# Altium project Thermostat_EEM.PrjPCB (part 6 of 6)

## Sheet EEM_connector.SchDoc: Stabilizer
size 420 x 297 mm; Author: G.Kasprowicz; CompanyName: WUT ISE; DrawnBy: G.Kasprowicz; Organization: WUT ISE; Address1: PW ISE; Address2: Nowowiejska 15/19 00-665 Warsaw; Address3: gkasprow@gmail.com; DocumentNumber: 7; Revision: 1.0; SheetNumber: 7; SheetTotal: 9; ModifiedBy: -; CheckedDate: -; Title2: EEM connector & drivers; DivGrp: WUT ISE; Designer: G.Kasprowicz; ModifiedDate: -; ProjectName: Sensor Box
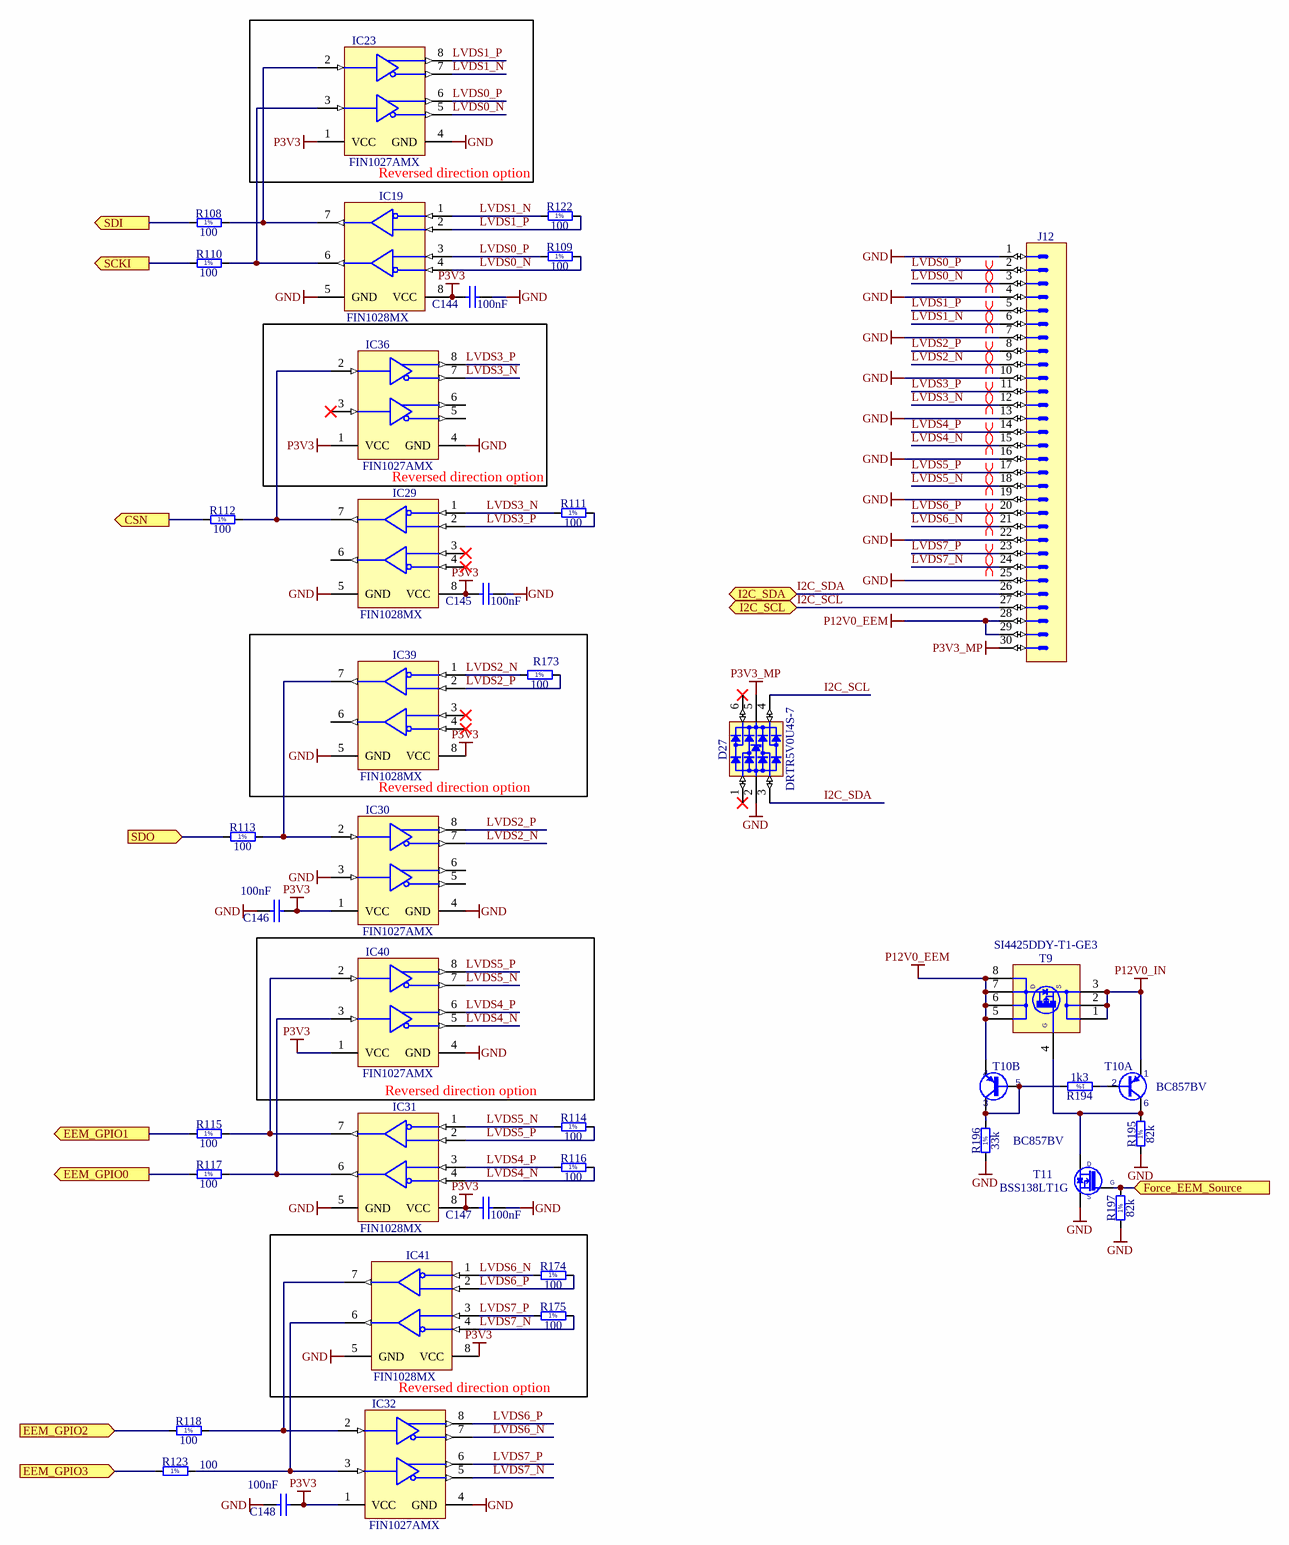
[diagram p7: EEM_connector.SchDoc]

### Parts
C144  100nF  [CAPC1005X55N]
C145  100nF  [CAPC1005X55N]
C146  100nF  [CAPC1005X55N]
C147  100nF  [CAPC1005X55N]
C148  100nF  [CAPC1005X55N]
D27  DRTR5V0U4S-7  [SOT65P210X110-6N]
IC19  FIN1028MX  [SOIC127P600X175-8N]
IC23  FIN1027AMX  [SOIC127P600X175-8N]
IC29  FIN1028MX  [SOIC127P600X175-8N]
IC30  FIN1027AMX  [SOIC127P600X175-8N]
IC31  FIN1028MX  [SOIC127P600X175-8N]
IC32  FIN1027AMX  [SOIC127P600X175-8N]
IC36  FIN1027AMX  [SOIC127P600X175-8N]
IC39  FIN1028MX  [SOIC127P600X175-8N]
IC40  FIN1027AMX  [SOIC127P600X175-8N]
IC41  FIN1028MX  [SOIC127P600X175-8N]
J12  (no value)  [3M_N2530-6002RB]
R108  100  [RESC1005X40N]
R109  100  [RESC1005X40N]
R110  100  [RESC1005X40N]
R111  100  [RESC1005X40N]
R112  100  [RESC1005X40N]
R113  100  [RESC1005X40N]
R114  100  [RESC1005X40N]
R115  100  [RESC1005X40N]
R116  100  [RESC1005X40N]
R117  100  [RESC1005X40N]
R118  100  [RESC1005X40N]
R122  100  [RESC1005X40N]
R123  100  [RESC1005X40N]
R173  100  [RESC1005X40N]
R174  100  [RESC1005X40N]
R175  100  [RESC1005X40N]
R194  1k3  [RESC1608X55N]
R195  82k  [RESC1608X55N]
R196  33k  [RESC1005X40N]
R197  82k  [RESC1608X55N]
T9  SI4425DDY-T1-GE3  [SOIC127P600X175-8N]
T10  BC857BV  [SOTFL50P160X60-6N]  (parts A,B of 2)
T11  BSS138LT1G  [SOT95P240X110-3N]

### Blocks framed on the sheet
Reversed direction option: IC23
Reversed direction option: IC36
Reversed direction option: IC39 R173
Reversed direction option: IC40
Reversed direction option: IC41 R174 R175

### Ports
CSN (out), EEM_GPIO0 (out), EEM_GPIO1 (out), EEM_GPIO2 (in), EEM_GPIO3 (in), Force_EEM_Source (in), I2C_SCL (bidir), I2C_SDA (bidir), SCKI (out), SDI (out), SDO (in)

### Nets
GND: C144.1 C145.1 C146.1 C147.1 C148.1 D27.2(GND) IC19.5(GND) IC23.4(GND) IC29.5(GND) IC30.3(DIN2RIN-) IC30.4(GND) IC31.5(GND) IC32.4(GND) IC36.4(GND) IC39.5(GND) IC40.4(GND) IC41.5(GND) J12.1 J12.4 J12.7 J12.10 J12.13 J12.16 J12.19 J12.22 J12.25 R195.1 R196.1 R197.1 T11.2(S)
P3V3: C144.2 C145.2 C146.2 C147.2 C148.2 IC19.8(VCC) IC23.1(VCC) IC29.8(VCC) IC30.1(VCC) IC31.8(VCC) IC32.1(VCC) IC36.1(VCC) IC39.8(VCC) IC40.1(VCC) IC41.8(VCC)
P3V3_MP: D27.5(VBUS) J12.30
P12V0_EEM: J12.28 J12.29 T9.5(D) T9.6(D) T9.7(D) T9.8(D) T10.4(E)
P12V0_IN: T9.1(S) T9.2(S) T9.3(S) T10.1(E)
I2C_SCL: D27.4(I/O3) J12.27 ; port I2C_SCL
I2C_SDA: D27.3(I/O2) J12.26 ; port I2C_SDA
LVDS0_N: IC19.4(RIN2-) IC23.5(DOUT-) J12.3 R109.2
LVDS0_P: IC19.3(RIN2+) IC23.6(DOUT+) J12.2 R109.1
LVDS1_N: IC19.1(RIN1-) IC23.7(DOUT-) J12.6 R122.1
LVDS1_P: IC19.2(RIN1+) IC23.8(DOUT+) J12.5 R122.2
LVDS2_N: IC30.7(DOUT-) IC39.1(RIN1-) J12.9 R173.1
LVDS2_P: IC30.8(DOUT+) IC39.2(RIN1+) J12.8 R173.2
LVDS3_N: IC29.1(RIN1-) IC36.7(DOUT-) J12.12 R111.1
LVDS3_P: IC29.2(RIN1+) IC36.8(DOUT+) J12.11 R111.2
LVDS4_N: IC31.4(RIN2-) IC40.5(DOUT-) J12.15 R116.2
LVDS4_P: IC31.3(RIN2+) IC40.6(DOUT+) J12.14 R116.1
LVDS5_N: IC31.1(RIN1-) IC40.7(DOUT-) J12.18 R114.1
LVDS5_P: IC31.2(RIN1+) IC40.8(DOUT+) J12.17 R114.2
LVDS6_N: IC32.7(DOUT-) IC41.1(RIN1-) J12.21 R174.1
LVDS6_P: IC32.8(DOUT+) IC41.2(RIN1+) J12.20 R174.2
LVDS7_N: IC32.5(DOUT-) IC41.4(RIN2-) J12.24 R175.2
LVDS7_P: IC32.6(DOUT+) IC41.3(RIN2+) J12.23 R175.1
NetIC9_73: R112.1 ; port CSN
NetIC9_75: R113.1 ; port SDO
NetIC9_76: R108.1 ; port SDI
NetIC9_114: R197.2 T11.1(G) ; port Force_EEM_Source
NetIC9_117: R110.1 ; port SCKI
NetIC9_118: R117.1 ; port EEM_GPIO0
NetIC9_119: R115.1 ; port EEM_GPIO1
NetIC9_122: R118.1 ; port EEM_GPIO2
NetIC9_123: R123.1 ; port EEM_GPIO3
NetIC19_6: IC19.6(ROUT2) IC23.3(DIN2RIN-) R110.2
NetIC19_7: IC19.7(ROUT1) IC23.2(DIN1) R108.2
NetIC29_7: IC29.7(ROUT1) IC36.2(DIN1) R112.2
NetIC30_2: IC30.2(DIN1) IC39.7(ROUT1) R113.2
NetIC31_6: IC31.6(ROUT2) IC40.3(DIN2RIN-) R117.2
NetIC31_7: IC31.7(ROUT1) IC40.2(DIN1) R115.2
NetIC32_2: IC32.2(DIN1) IC41.7(ROUT1) R118.2
NetIC32_3: IC32.3(DIN2RIN-) IC41.6(ROUT2) R123.2
NetR194_1: R194.1 T10.2(B)
NetR194_2: R194.2 R196.2 T10.3(C) T10.5(B)
NetR195_2: R195.2 T9.4(S) T10.6(C) T11.3(D)

Not connected (* = marked no-connect by the designer): D27 1(I/O1)* 6(I/O4)*; IC29 3(RIN2+)* 4(RIN2-)* 6(ROUT2); IC30 5(DOUT-) 6(DOUT+); IC36 3(DIN2RIN-)* 5(DOUT-) 6(DOUT+); IC39 3(RIN2+)* 4(RIN2-)* 6(ROUT2)

### Layout directives
differential pair: LVDS0_N, LVDS0_P, LVDS1_N, LVDS1_P, LVDS2_N, LVDS2_P, LVDS3_N, LVDS3_P, LVDS4_N, LVDS4_P, LVDS5_N, LVDS5_P, LVDS6_N, LVDS6_P, LVDS7_N, LVDS7_P

### Notes on the sheet
- Project/Equipment
- Document
- Designer
- Drawn by
- Check.by
- Copyright WUT ISE 2024.
  This documentation describes Open Hardware and is licensed under the CERN OHL-W v.2.0. You may redistribute and modify this documentation under the terms of the CERN OHL-W v.2.0. (http://ohwr.org/CERNOHL). This documentation is distributed WITHOUT ANY EXPRESS OR IMPLIED WARRANTY, INCLUDING OF MERCHANTABILITY, SATISFACTORY QUALITY AND FITNESS FOR A PARTICULAR PURPOSE. Please see the CERN OHL v.2.0 for applicable conditions.
- Contact
- File
- Last Mod.
- Print Date
- Sheet
- Size
- A3
- of
- Rev
- (in symbol R0402_33K_1%_0.0625W_100PPM) 1%
- (in symbol R0402_100R_1%_0.0625W_100PPM) 1%
- (in symbol R0603_1K3_1%_0.1W_100PPM) 1%
- (in symbol R0603_82K_1%_0.1W_100PPM) 1%
- (in symbol SI4425DDY-T1-GE3) G

### Library data of the parts
C144-C148 = CC0402_100NF_16V_10%_X5R: as C79-C81 on sheet RMII_Ethernet; Part Number: CC0402_100NF_16V_10%_X5R; Component Kind: Standard; Component Type: Standard; Pin Count: 2; Value: 100nF; Status: None; Manufacturer Part Number: CC0402_100NF_16V_10%_X5R; Case: 0402; Mounted: Yes; Socket: No; SMD: Yes; Sense: No; Manufacturer1 Example: MURATA; Manufacturer1 ComponentHeight: 0.55mm; HelpURL: \\cern.ch\dfs\Applications\Altium\Datasheets\CC0402_X5R_MURATA_GRM.pdf; Author: CERN DEM JLC; CreateDate: 10.12.2013; LatestRevisionDate: 10.12.2013
D27 = D_TVS_DRTR5V0U4S-7: Integrated Quad Ultra-Low Capacitance ESD Protection; Part Description: Integrated Quad Ultra-Low Capacitance ESD (±8kV) Protection; Manufacturer: DIODES; PressFit: No; Bonding: No; Status Comment: Active; Part Number: DRTR5V0U4S-7; Component Kind: Standard; Component Type: Standard; Device: DRTR5V0U4S-7; PackageDescription: SOT363, SC70-6, 0.65mm Pitch; 6 Pin, 1.25mm W X 2.00mm L X 1.10mm H body, IPC Medium Density; Status: Active; Manufacturer Part Number: DRTR5V0U4S-7; Pin Count: 6; Case: SOT363; Mounted: Yes; Socket: No; SMD: Yes; Sense: No; ComponentHeight: 1.1mm; HelpURL: \\cern.ch\dfs\Applications\Altium\Datasheets\PRTR5V0U4Y.pdf; Author: GK; CreateDate: 24.01.2017; LatestRevisionDate: 14.09.2020
IC19 IC29 IC31 IC39 IC41 = IFC_FIN1028: 3.3V LVDS 2-Bit High-Speed Differential Reciever; Manufacturer: ON Semiconductor; PressFit: No; Bonding: No; Part Number: FIN1028MX; Component Kind: Standard; Component Type: Standard; Device: FIN1028MX; PackageDescription: SOIC 8, Pitch 1.27mm - Body 4x5mm, IPC Medium Density; Part Description: 3.3V LVDS 2-Bit High-Speed Differential Reciever; Manufacturer Part Number: FIN1028MX; Pin Count: 8; Case: SOIC8; Mounted: Yes; Socket: No; SMD: Yes; Sense: No; ComponentHeight: 0.8mm; Author: GK; HelpURL: \\cern.ch\dfs\Applications\Altium\Datasheets\FIN1101K8X.pdf; CreateDate: 08/11/2016; LatestRevisionDate: 08/11/2016
IC23 IC30 IC32 IC36 IC40 = IFC_FIN1027A: 3.3V LVDS, 2-Bit, High-Speed, Differential Driver; Manufacturer: ON Semiconductor; PressFit: No; Bonding: No; Part Number: FIN1027AMX; Component Kind: Standard; Component Type: Standard; Device: FIN1027AMX; PackageDescription: SOIC 8, Pitch 1.27mm - Body 4x5mm, IPC Medium Density; Part Description: 3.3V LVDS, 2-Bit, High-Speed, Differential Driver; Manufacturer Part Number: FIN1027AMX; Pin Count: 8; Case: SOIC8; Mounted: Yes; Socket: No; SMD: Yes; Sense: No; ComponentHeight: 0.8mm; Author: GK; HelpURL: \\cern.ch\dfs\Applications\Altium\Datasheets\FIN1101K8X.pdf; CreateDate: 08/11/2016; LatestRevisionDate: 08/11/2016
J12 = 3M_N2530-6002RB: Connector 30 Male; Part Description: 30 Contacts - Straight .100'' x .100'' Low Profile Four-Wall Header, 2500 Series; Manufacturer: 3M; PressFit: No; Part Number: 3M_N2530-6002RB; Component Kind: Standard; Component Type: Standard; Pin Count: 30; Family: Header 30; Mounted: Yes; Socket: No; SMD: No; Sense: No; Status: None; Manufacturer Part Number: N2530-6002RB; ComponentHeight: 10.03mm; HelpURL: \\cern.ch\dfs\Applications\Altium\Datasheets\3M_N2530-6002RB.pdf; Author: CERN DEM JLC; CreateDate: 11.02.2009; LatestRevisionDate: 11.08.2009
R108-R118 R122 R123 R173-R175 = R0402_100R_1%_0.0625W_100PPM: Resistor - 1%; Part Description: General Purpose Thick Film Chip Resistor; Manufacturer: GENERIC; Manufacturer1 Part Number: 232270671001L; TC: ±100ppm/°C; PressFit: No; Part Number: R0402_100R_1%_0.0625W_100PPM; Component Kind: Standard; Component Type: Standard; Pin Count: 2; Value: 100; Status: Not Recommended; Power: 0.0625W; Tolerance: ±1%; Manufacturer Part Number: R0402_100R_1%_0.0625W_100PPM; Case: 0402; Mounted: Yes; Sense: No; Socket: No; SMD: Yes; Manufacturer1 Example: YAGEO PHYCOMP; Manufacturer1 ComponentHeight: 0.4mm; HelpURL: \\cern.ch\dfs\Applications\Altium\Datasheets\R0402_Phycomp_RC0402.pdf; Author: CERN DEM JLC; CreateDate: 03.12.2007; LatestRevisionDate: 17.10.2012
R194 = R0603_1K3_1%_0.1W_100PPM: Resistor - 1%; Part Description: General Purpose Thick Film Chip Resistor; Manufacturer: GENERIC; Manufacturer1 Part Number: NRC06F1301TRF; Power: 0.1W; TC: ±100ppm/°C; PressFit: No; Part Number: R0603_1K3_1%_0.1W_100PPM; Component Kind: Standard; Component Type: Standard; Pin Count: 2; Value: 1k3; Status: Preferred; Tolerance: ±1%; Manufacturer Part Number: R0603_1K3_1%_0.1W_100PPM; Case: 0603; Mounted: Yes; Sense: No; Socket: No; SMD: Yes; Manufacturer1 Example: NIC COMPONENT; Manufacturer1 ComponentHeight: 0.55mm; HelpURL: \\cern.ch\dfs\Applications\Altium\Datasheets\R0603_NIC_NRC.pdf; Author: CERN DEM JLC; CreateDate: 03.12.2007; LatestRevisionDate: 13.03.2008
R195 R197 = R0603_82K_1%_0.1W_100PPM: Resistor - 1%; Part Description: General Purpose Thick Film Chip Resistor; Manufacturer: GENERIC; Manufacturer1 Part Number: NRC06F8202TRF; Power: 0.1W; TC: ±100ppm/°C; Part Number: R0603_82K_1%_0.1W_100PPM; Component Kind: Standard; Component Type: Standard; Pin Count: 2; Value: 82k; Status: Preferred; Tolerance: ±1%; Manufacturer Part Number: R0603_82K_1%_0.1W_100PPM; Case: 0603; Mounted: Yes; Sense: No; Socket: No; SMD: Yes; Manufacturer1 Example: NIC COMPONENT; Manufacturer1 ComponentHeight: 0.55mm; HelpURL: \\cern.ch\dfs\Applications\Altium\Datasheets\R0603_NIC_NRC.pdf; Author: CERN DEM JLC; CreateDate: 03.12.2007; LatestRevisionDate: 13.03.2008
R196 = R0402_33K_1%_0.0625W_100PPM: Resistor - 1%; Part Description: General Purpose Thick Film Chip Resistor; Manufacturer: GENERIC; Manufacturer1 Part Number: 232270673303L; TC: ±100ppm/°C; PressFit: No; Part Number: R0402_33K_1%_0.0625W_100PPM; Component Kind: Standard; Component Type: Standard; Pin Count: 2; Value: 33k; Status: Not Recommended; Power: 0.0625W; Tolerance: ±1%; Manufacturer Part Number: R0402_33K_1%_0.0625W_100PPM; Case: 0402; Mounted: Yes; Sense: No; Socket: No; SMD: Yes; Manufacturer1 Example: YAGEO PHYCOMP; Manufacturer1 ComponentHeight: 0.4mm; HelpURL: \\cern.ch\dfs\Applications\Altium\Datasheets\R0402_Phycomp_RC0402.pdf; Author: CERN DEM JLC; CreateDate: 03.12.2007; LatestRevisionDate: 17.10.2012
T9 = SI4425DDY-T1-GE3: -30V -19.7A P-Channel MOSFET; Manufacturer: VISHAY SILICONIX; PressFit: No; Bonding: No; Part Number: SI4425DDY-T1-GE3; Component Kind: Standard; Component Type: Standard; Device: SI4425DDY-T1-GE3; PackageDescription: SOIC 8, Pitch 1.27mm - Body 4x5mm, IPC Medium Density; Part Description: -30V -19.7A P-Channel MOSFET; Manufacturer Part Number: SI4425DDY-T1-GE3; Pin Count: 8; Case: SOIC8; Mounted: Yes; Socket: No; SMD: Yes; Sense: No; ComponentHeight: 1.75mm; HelpURL: \\cern.ch\dfs\Applications\Altium\Datasheets\SI4425DDY-T1-GE3.pdf; Author: CERN DEM MR; CreateDate: 05/10/2016; LatestRevisionDate: 05/10/2016
T10 = BC857BV: 45V, 100mA PNP General Purpose Double Transistor; Part Description: -45V -100mA PNP General Purpose Double Transistor; Manufacturer: NXP SEMICONDUCTORS; PressFit: No; Bonding: No; Part Number: BC857BV; Component Kind: Standard; Component Type: Standard; Device: BC857BV; PackageDescription: SOTFL (SOT666), 0.50mm, Pitch; 6 Pin, 1.20mm W X 1.60mm L X 0.60mm H Body, IPC Medium Density; Manufacturer Part Number: BC857BV; Pin Count: 6; Case: SOT666; Mounted: Yes; Socket: No; SMD: Yes; Sense: No; ComponentHeight: 0.6mm; HelpURL: \\cern.ch\dfs\Applications\Altium\Datasheets\BC857BV.pdf; Author: CERN DEM JLC; CreateDate: 01/12/2011; LatestRevisionDate: 01/12/2011
T11 = BSS138LT1G: N-CHANNEL MOSFET WITH DIODE; Part Description: 50V 200mA N-Channel Enhancement Mode Field-Effect Transistor; Manufacturer: ON SEMICONDUCTOR; PressFit: No; Bonding: No; Part Number: BSS138LT1G; Component Kind: Standard; Component Type: Standard; Device: BSS138LT1G; PackageDescription: SOT23 3-Leads, Pitch 0.95mm - Body 1.4x3mm, IPC Medium Density; Manufacturer Part Number: BSS138LT1G; Pin Count: 3; Case: SOT23-3; Mounted: Yes; Socket: No; SMD: Yes; Sense: No; ComponentHeight: 1.11mm; HelpURL: \\cern.ch\dfs\Applications\Altium\Datasheets\BSS138LT1G.pdf; Author: CERN DEM JLC; CreateDate: 23.03.2009; LatestRevisionDate: 23.03.2009

## Nets that join several sheets
GND: Thermostat_EEM (15 pins), CPU_STM32F4 (56 pins), U_AFE0 (35 pins), U_TEC_driver0 (37 pins), U_TEC_driver1 (37 pins), RMII_Ethernet (24 pins), USB (6 pins), U_AFE1 (35 pins), U_AFE2 (35 pins), U_AFE3 (35 pins), U_TEC_driver2 (37 pins), U_TEC_driver3 (37 pins), Supply (98 pins), EEM_connector (30 pins)
P3V0REF: CPU_STM32F4 (R70.2), U_TEC_driver0 (C26_1.1 IC5_1.2), U_TEC_driver1 (C26_2.1 IC5_2.2), U_TEC_driver2 (C26_3.1 IC5_3.2), U_TEC_driver3 (C26_4.1 IC5_4.2), Supply (6 pins)
P3V3: Thermostat_EEM (5 pins), CPU_STM32F4 (38 pins), RMII_Ethernet (8 pins), Supply (14 pins), EEM_connector (15 pins)
P3V3_MP: Thermostat_EEM (5 pins), Supply (D2.1 R10.1), EEM_connector (D27.5 J12.30)
P3V3IO: U_AFE0 (R38_1.2), U_AFE1 (R38_2.2), U_AFE2 (R38_3.2), U_AFE3 (R38_4.2), Supply (C115.2 IC12.5)
P5V0: CPU_STM32F4 (R82.1), U_TEC_driver0 (15 pins), U_TEC_driver1 (15 pins), U_TEC_driver2 (15 pins), U_TEC_driver3 (15 pins), Supply (45 pins)
P5V0A: Thermostat_EEM (J2.33 R1.2 R2.2), U_AFE0 (8 pins), U_TEC_driver0 (R71_1.2), U_TEC_driver1 (R71_2.2), U_AFE1 (8 pins), U_AFE2 (8 pins), U_AFE3 (8 pins), U_TEC_driver2 (R71_3.2), U_TEC_driver3 (R71_4.2), Supply (7 pins)
P12V0: CPU_STM32F4 (R83.2), Supply (46 pins)
P12V0_IN: Supply (12 pins), EEM_connector (T9.1 T9.2 T9.3 T10.1)
~{SHDN}0: CPU_STM32F4 (IC9.89), U_TEC_driver0 (R120_1.2)
~{SHDN}1: CPU_STM32F4 (IC9.90), U_TEC_driver1 (R120_2.2)
~{SHDN}2: CPU_STM32F4 (IC9.91), U_TEC_driver2 (R120_3.2)
~{SHDN}3: CPU_STM32F4 (IC9.92), U_TEC_driver3 (R120_4.2)
ADC_CLKIO: CPU_STM32F4 (IC9.100), U_AFE0 (IC7_1.10), U_AFE1 (IC7_2.10), U_AFE2 (IC7_3.10), U_AFE3 (IC7_4.10)
ADC_CSn0: CPU_STM32F4 (IC9.141), U_AFE0 (B1_1.1 IC7_1.14)
ADC_CSn1: CPU_STM32F4 (IC9.142), U_AFE1 (B1_2.1 IC7_2.14)
ADC_CSn2: CPU_STM32F4 (IC9.2), U_AFE2 (B1_3.1 IC7_3.14)
ADC_CSn3: CPU_STM32F4 (IC9.3), U_AFE3 (B1_4.1 IC7_4.14)
ADC_DIN: CPU_STM32F4 (IC9.5), U_AFE0 (B3_1.1 IC7_1.12), U_AFE1 (B3_2.1 IC7_2.12), U_AFE2 (B3_3.1 IC7_3.12), U_AFE3 (B3_4.1 IC7_4.12)
ADC_DOUT/RDYn: CPU_STM32F4 (IC9.4 R226.1), U_AFE0 (B4_1.1 IC7_1.11), U_AFE1 (B4_2.1 IC7_2.11), U_AFE2 (B4_3.1 IC7_3.11), U_AFE3 (B4_4.1 IC7_4.11)
ADC_SCLK: CPU_STM32F4 (IC9.1), U_AFE0 (B2_1.1 IC7_1.13), U_AFE1 (B2_2.1 IC7_2.13), U_AFE2 (B2_3.1 IC7_3.13), U_AFE3 (B2_4.1 IC7_4.13)
ADC_SYNC: CPU_STM32F4 (IC9.70), U_AFE0 (IC7_1.15), U_AFE1 (IC7_2.15), U_AFE2 (IC7_3.15), U_AFE3 (IC7_4.15)
AFE_SCL: Thermostat_EEM (D3.3 J2.35), CPU_STM32F4 (B15.1 IC9.11 R61.1)
AFE_SDA: Thermostat_EEM (D3.4 J2.34), CPU_STM32F4 (B14.1 IC9.10 R53.1)
AT_EVENT: CPU_STM32F4 (IC9.58), Supply (IC6.4 R67.1)
CPU_RESETn: CPU_STM32F4 (D5.1 IC13.2), Supply (T6.1)
DAC_SCLK: CPU_STM32F4 (IC9.111), U_TEC_driver0 (B12_1.1 IC5_1.6), U_TEC_driver1 (B12_2.1 IC5_2.6), U_TEC_driver2 (B12_3.1 IC5_3.6), U_TEC_driver3 (B12_4.1 IC5_4.6)
DAC_SDIN: CPU_STM32F4 (IC9.113), U_TEC_driver0 (B11_1.1 IC5_1.7), U_TEC_driver1 (B11_2.1 IC5_2.7), U_TEC_driver2 (B11_3.1 IC5_3.7), U_TEC_driver3 (B11_4.1 IC5_4.7)
DAC_SYNCn0: CPU_STM32F4 (IC9.88), U_TEC_driver0 (B13_1.1 IC5_1.5)
DAC_SYNCn1: CPU_STM32F4 (IC9.87), U_TEC_driver1 (B13_2.1 IC5_2.5)
DAC_SYNCn2: CPU_STM32F4 (IC9.57), U_TEC_driver2 (B13_3.1 IC5_3.5)
DAC_SYNCn3: CPU_STM32F4 (IC9.56), U_TEC_driver3 (B13_4.1 IC5_4.5)
FAN_PWM: CPU_STM32F4 (IC9.97), Supply (C82.1)
Freq: CPU_STM32F4 (IC9.116), U_TEC_driver0 (IC38_1.3), U_TEC_driver1 (IC38_2.3), U_TEC_driver2 (IC38_3.3), U_TEC_driver3 (IC38_4.3)
I2C1_SCL: Thermostat_EEM (R3.1 T2.2), CPU_STM32F4 (IC9.139)
I2C1_SDA: Thermostat_EEM (R4.1 T1.2), CPU_STM32F4 (IC9.140)
I2C_SCL: Thermostat_EEM (IC1.2 IC2.1 T2.3 TP2.1), EEM_connector (D27.4 J12.27)
I2C_SDA: Thermostat_EEM (IC1.1 IC2.3 T1.3 TP1.1), EEM_connector (D27.3 J12.26)
I_meas_P12V0: CPU_STM32F4 (IC9.20), Supply (C89.1 R141.2)
ITEC0: CPU_STM32F4 (IC9.41), U_TEC_driver0 (R225_1.1)
ITEC1: CPU_STM32F4 (IC9.42), U_TEC_driver1 (R225_2.1)
ITEC2: CPU_STM32F4 (IC9.46), U_TEC_driver2 (R225_3.1)
ITEC3: CPU_STM32F4 (IC9.47), U_TEC_driver3 (R225_4.1)
NetIC9_73: CPU_STM32F4 (IC9.73), EEM_connector (R112.1)
NetIC9_75: CPU_STM32F4 (IC9.75), EEM_connector (R113.1)
NetIC9_76: CPU_STM32F4 (IC9.76), EEM_connector (R108.1)
NetIC9_114: CPU_STM32F4 (IC9.114), EEM_connector (R197.2 T11.1)
NetIC9_117: CPU_STM32F4 (IC9.117), EEM_connector (R110.1)
NetIC9_118: CPU_STM32F4 (IC9.118), EEM_connector (R117.1)
NetIC9_119: CPU_STM32F4 (IC9.119), EEM_connector (R115.1)
NetIC9_122: CPU_STM32F4 (IC9.122), EEM_connector (R118.1)
NetIC9_123: CPU_STM32F4 (IC9.123), EEM_connector (R123.1)
NRST: CPU_STM32F4 (IC9.129), RMII_Ethernet (IC11.15 R125.2)
OVERTHERMn: Thermostat_EEM (IC1.3 R5.2 R6.2), CPU_STM32F4 (IC9.127), U_TEC_driver0 (D1_1.1), U_TEC_driver1 (D1_2.1), U_TEC_driver2 (D1_3.1), U_TEC_driver3 (D1_4.1)
POE_PWR_SRC: CPU_STM32F4 (IC9.12), Supply (R30.1 R31.2)
POE_VC+: RMII_Ethernet (D7.1 D10.1 D11.1 D22.1), Supply (L1.1 R14.2)
POE_VC-: RMII_Ethernet (D6.2 D8.2 D9.2 D23.2), Supply (R35.1 R64.1 R66.1 T4.2)
PWM_maxINeg0: CPU_STM32F4 (IC9.96), U_TEC_driver0 (B5_1.1 R55_1.1)
PWM_maxINeg1: CPU_STM32F4 (IC9.135), U_TEC_driver1 (B5_2.1 R55_2.1)
PWM_maxINeg2: CPU_STM32F4 (IC9.98), U_TEC_driver2 (B5_3.1 R55_3.1)
PWM_maxINeg3: CPU_STM32F4 (IC9.99), U_TEC_driver3 (B5_4.1 R55_4.1)
PWM_maxIPos0: CPU_STM32F4 (IC9.81), U_TEC_driver0 (B6_1.1 R57_1.1)
PWM_maxIPos1: CPU_STM32F4 (IC9.82), U_TEC_driver1 (B6_2.1 R57_2.1)
PWM_maxIPos2: CPU_STM32F4 (IC9.85), U_TEC_driver2 (B6_3.1 R57_3.1)
PWM_maxIPos3: CPU_STM32F4 (IC9.86), U_TEC_driver3 (B6_4.1 R57_4.1)
PWM_maxV0: CPU_STM32F4 (IC9.60), U_TEC_driver0 (B7_1.1 R59_1.1)
PWM_maxV1: CPU_STM32F4 (IC9.64), U_TEC_driver1 (B7_2.1 R59_2.1)
PWM_maxV2: CPU_STM32F4 (IC9.66), U_TEC_driver2 (B7_3.1 R59_3.1)
PWM_maxV3: CPU_STM32F4 (IC9.67), U_TEC_driver3 (B7_4.1 R59_4.1)
RMII_CRS_DV: CPU_STM32F4 (IC9.43), RMII_Ethernet (R27.1)
RMII_MDC: CPU_STM32F4 (IC9.27), RMII_Ethernet (B16.1 IC11.13)
RMII_MDIO: CPU_STM32F4 (IC9.36), RMII_Ethernet (B17.1 IC11.12 R98.2)
RMII_REF_CLK: CPU_STM32F4 (IC9.35), RMII_Ethernet (R29.1)
RMII_RXD0: CPU_STM32F4 (IC9.44), RMII_Ethernet (R23.1)
RMII_RXD1: CPU_STM32F4 (IC9.45), RMII_Ethernet (R24.1)
RMII_TX_EN: CPU_STM32F4 (IC9.126), RMII_Ethernet (IC11.16)
RMII_TXD0: CPU_STM32F4 (IC9.128), RMII_Ethernet (IC11.17)
RMII_TXD1: CPU_STM32F4 (IC9.74), RMII_Ethernet (IC11.18)
SENS0_1: Thermostat_EEM (J2.23), U_AFE0 (R40_1.1 R91_1.1)
SENS0_2: Thermostat_EEM (J2.8), U_AFE0 (R42_1.1 R44_1.1)
SENS0_N: Thermostat_EEM (J2.10), U_AFE1 (R42_2.1 R44_2.1)
SENS0_N: Thermostat_EEM (J2.12), U_AFE2 (R42_3.1 R44_3.1)
SENS0_N: Thermostat_EEM (J2.14), U_AFE3 (R42_4.1 R44_4.1)
SENS0_P: Thermostat_EEM (J2.25), U_AFE1 (R40_2.1 R91_2.1)
SENS0_P: Thermostat_EEM (J2.27), U_AFE2 (R40_3.1 R91_3.1)
SENS0_P: Thermostat_EEM (J2.29), U_AFE3 (R40_4.1 R91_4.1)
SENS1_1: Thermostat_EEM (J2.24), U_AFE0 (R46_1.1 R50_1.1)
SENS1_2: Thermostat_EEM (J2.9), U_AFE0 (R48_1.1 R132_1.1)
SENS1_N: Thermostat_EEM (J2.11), U_AFE1 (R48_2.1 R132_2.1)
SENS1_N: Thermostat_EEM (J2.13), U_AFE2 (R48_3.1 R132_3.1)
SENS1_N: Thermostat_EEM (J2.15), U_AFE3 (R48_4.1 R132_4.1)
SENS1_P: Thermostat_EEM (J2.26), U_AFE1 (R46_2.1 R50_2.1)
SENS1_P: Thermostat_EEM (J2.28), U_AFE2 (R46_3.1 R50_3.1)
SENS1_P: Thermostat_EEM (J2.30), U_AFE3 (R46_4.1 R50_4.1)
TACHO: CPU_STM32F4 (IC9.69), Supply (R9.1)
TEC0+: Thermostat_EEM (J2.31 J2.32), U_TEC_driver0 (L3_1.4)
TEC0-: Thermostat_EEM (J2.1 J2.16), U_TEC_driver0 (L3_1.3)
TEC1+: Thermostat_EEM (J2.2 J2.17), U_TEC_driver1 (L3_2.4)
TEC1-: Thermostat_EEM (J2.3 J2.18), U_TEC_driver1 (L3_2.3)
TEC2+: Thermostat_EEM (J2.4 J2.19), U_TEC_driver2 (L3_3.4)
TEC2-: Thermostat_EEM (J2.5 J2.20), U_TEC_driver2 (L3_3.3)
TEC3+: Thermostat_EEM (J2.6 J2.21), U_TEC_driver3 (L3_4.4)
TEC3-: Thermostat_EEM (J2.7 J2.22), U_TEC_driver3 (L3_4.3)
TEC_U_meas0: CPU_STM32F4 (IC9.29), U_TEC_driver0 (B23_1.1 C83_1.2 R77_1.2)
TEC_U_meas1: CPU_STM32F4 (IC9.34), U_TEC_driver1 (B23_2.1 C83_2.2 R77_2.2)
TEC_U_meas2: CPU_STM32F4 (IC9.37), U_TEC_driver2 (B23_3.1 C83_3.2 R77_3.2)
TEC_U_meas3: CPU_STM32F4 (IC9.40), U_TEC_driver3 (B23_4.1 C83_4.2 R77_4.2)
USB_ID: CPU_STM32F4 (IC9.102), USB (C108.2 D21.1 FB2.1)
USB_N: CPU_STM32F4 (IC9.103), USB (D21.3 L9.3)
USB_P: CPU_STM32F4 (IC9.104), USB (D21.4 L9.2)
USB_VBUS: CPU_STM32F4 (R34.2), USB (R73.1 R75.1)
Vref0: CPU_STM32F4 (IC9.13), U_TEC_driver0 (IC10_1.3 IC10_1.4 R79_1.1 R80_1.1)
Vref1: CPU_STM32F4 (IC9.14), U_TEC_driver1 (IC10_2.3 IC10_2.4 R79_2.1 R80_2.1)
Vref2: CPU_STM32F4 (IC9.15), U_TEC_driver2 (IC10_3.3 IC10_3.4 R79_3.1 R80_3.1)
Vref3: CPU_STM32F4 (IC9.18), U_TEC_driver3 (IC10_4.3 IC10_4.4 R79_4.1 R80_4.1)
Vref+: Thermostat_EEM (J2.37), U_AFE0 (R50_1.2 R91_1.2 R129_1.1 R140_1.1)
Vref+: Thermostat_EEM (J2.39), U_AFE1 (R50_2.2 R91_2.2 R129_2.1 R140_2.1)
Vref+: Thermostat_EEM (J2.41), U_AFE2 (R50_3.2 R91_3.2 R129_3.1 R140_3.1)
Vref+: Thermostat_EEM (J2.43), U_AFE3 (R50_4.2 R91_4.2 R129_4.1 R140_4.1)
Vref-: Thermostat_EEM (J2.38), U_AFE0 (R44_1.2 R130_1.1 R132_1.2 R152_1.1)
Vref-: Thermostat_EEM (J2.40), U_AFE1 (R44_2.2 R130_2.1 R132_2.2 R152_2.1)
Vref-: Thermostat_EEM (J2.42), U_AFE2 (R44_3.2 R130_3.1 R132_3.2 R152_3.1)
Vref-: Thermostat_EEM (J2.44), U_AFE3 (R44_4.2 R130_4.1 R132_4.2 R152_4.1)

## Assembly variants
Default: not fitted C102 C103 C160 C161 IC15 IC23 IC36 IC39 IC40 IC41 J4 R44_1 R44_2 R44_3 R44_4 R50_1 R50_2 R50_3 R50_4 R91_1 R91_2 R91_3 R91_4 R126_1 R126_2 R126_3 R126_4 R127_1 R127_2 R127_3 R127_4 R129_1 R129_2 R129_3 R129_4 R130_1 R130_2 R130_3 R130_4 R132_1 R132_2 R132_3 R132_4 R221 R227 R229 R231